# EAGLE design ArduiniBrd (EAGLE 5.12)
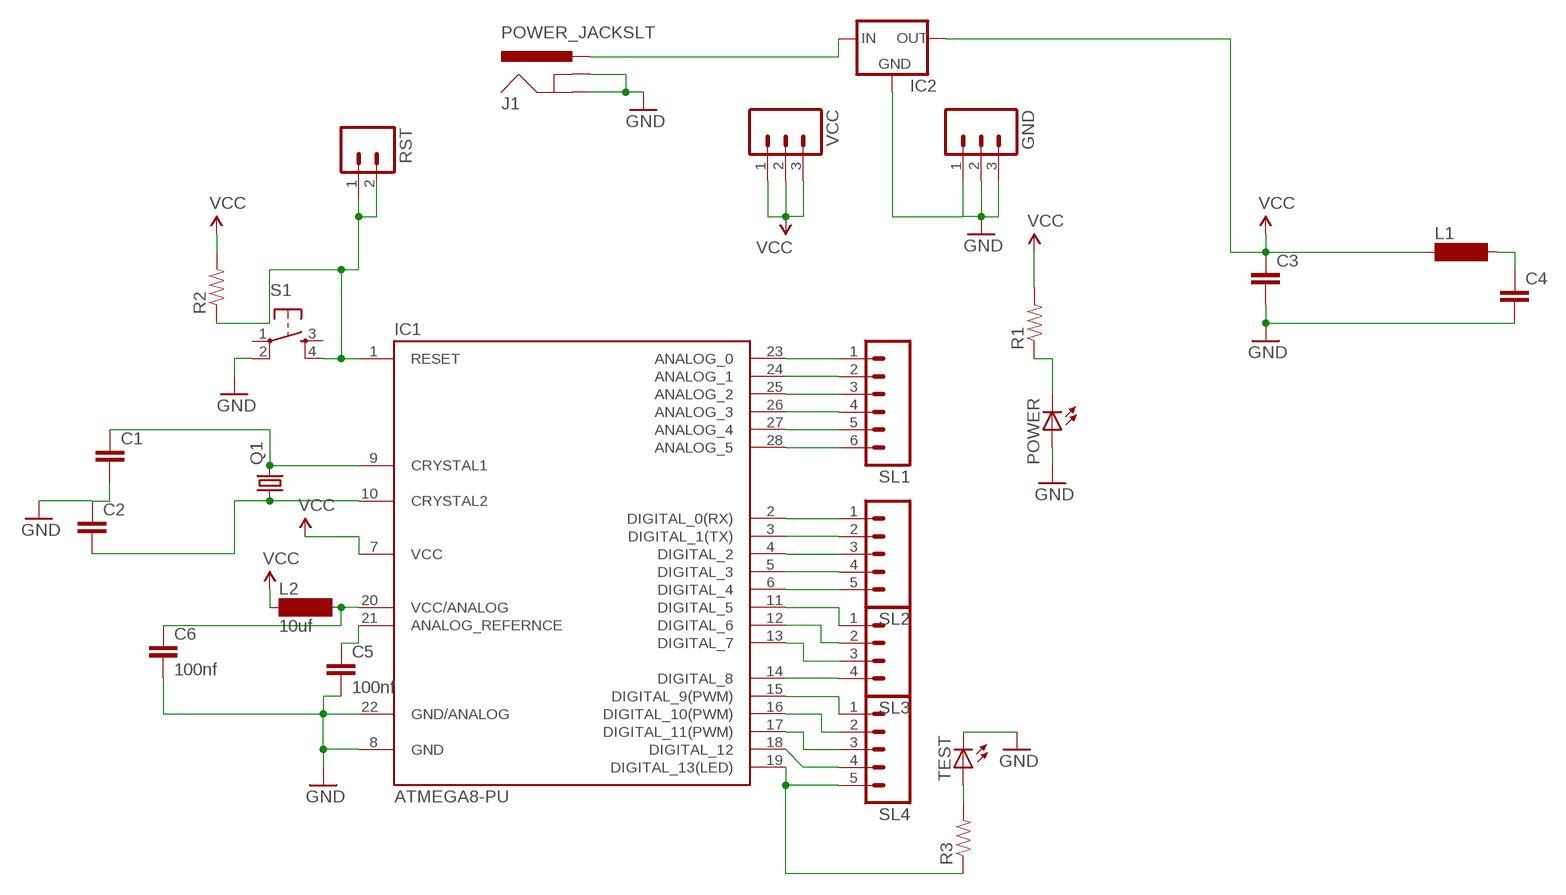
[diagram p0: schematic, sheet 1]

## Parts
C1  CAPPTH  [CAP-PTH-SMALL]
C2  CAPPTH  [CAP-PTH-SMALL]
C3  CAPPTH  [CAP-PTH-SMALL]
C4  CAPPTH  [CAP-PTH-SMALL]
C5  100nf  CAPPTH  [CAP-PTH-SMALL]
C6  100nf  CAPPTH  [CAP-PTH-SMALL]
GND  M03  [03P]
IC1  ATMEGA8-PU  [DIL28-3]
IC2  V_REG_78XXSIDE  [78XXL]
J1  POWER_JACKSLT  [POWER_JACK_SLOT]
L1  SD75  [SD75]
L2  10uf  SD75  [SD75]
POWER  LED5MM  [LED5MM]
Q1  CRYSTALHC18U-V  [HC18U-V]
R1  RESISTORKIT  [AXIAL-0.3-KIT]
R2  RESISTORKIT  [AXIAL-0.3-KIT]
R3  RESISTORPTH-1/6W  [1/6W-RES]
RST  M02  [02P]
S1  TAC_SWITCHPTH  [TACTILE-PTH]
SL1  M06  [06P]
SL2  M05  [05P]
SL3  M04  [04P]
SL4  M05  [05P]
TEST  LED5MM  [LED5MM]
VCC  M03  [03P]

## Nets
GND: C1.2 C2.1 C3.2 C4.2 C5.2 C6.2 GND.1 GND.2 GND.3 IC1.8(GND) IC1.22(GND/ANALOG) IC2.GND J1.GND@1(GNDBREAK) J1.GND@2(GND) POWER.A S1.2 TEST.K(C)
N$1: C1.1 IC1.9(CRYSTAL1) Q1.2
N$2: C2.2 IC1.10(CRYSTAL2) Q1.1
N$3: IC1.18(DIGITAL_12) SL4.4
N$4: POWER.K(C) R1.P$1
N$5: R3.2 TEST.A
N$6: IC1.19(DIGITAL_13(LED)) R3.1 SL4.5
N$7: IC1.1(RESET) R2.P$1 RST.1 S1.4
N$8: IC1.17(DIGITAL_11(PWM)) SL4.3
N$9: IC1.23(ANALOG_0) SL1.1
N$10: IC1.24(ANALOG_1) SL1.2
N$11: IC1.25(ANALOG_2) SL1.3
N$12: IC1.26(ANALOG_3) SL1.4
N$13: IC1.27(ANALOG_4) SL1.5
N$14: IC1.28(ANALOG_5) SL1.6
N$15: IC1.2(DIGITAL_0(RX)) SL2.1
N$16: IC1.3(DIGITAL_1(TX)) SL2.2
N$17: IC1.4(DIGITAL_2) SL2.3
N$18: IC1.5(DIGITAL_3) SL2.4
N$19: IC1.6(DIGITAL_4) SL2.5
N$20: IC1.15(DIGITAL_9(PWM)) SL4.1
N$21: IC1.11(DIGITAL_5) SL3.1
N$22: IC1.12(DIGITAL_6) SL3.2
N$23: IC1.13(DIGITAL_7) SL3.3
N$24: IC1.14(DIGITAL_8) SL3.4
N$25: IC1.16(DIGITAL_10(PWM)) SL4.2
N$26: IC2.IN J1.PWR
N$27: C6.1 IC1.20(VCC/ANALOG) L2.2
N$28: C4.1 L1.2
N$29: C5.1 IC1.21(ANALOG_REFERNCE)
VCC: C3.1 IC1.7(VCC) IC2.OUT L1.1 L2.1 R1.P$2 R2.P$2 VCC.1 VCC.2 VCC.3
Unconnected: RST.2 S1.1 S1.3

## Library data of the parts
C1-C6 = SparkFun:CAP: Capacitor Standard 0603 ceramic capacitor, and 0.1" leaded capacitor.
GND VCC = con-amp-quick:M03: AMP QUICK CONNECTOR; OC_FARNELL: unknown; OC_NEWARK: unknown
IC1 = Arduino-AVR:ATMEGA8-PU
IC2 = SparkFun:V_REG_78XX: Voltage Regulator Standard 7805 5V regulator. IGO (Input Ground Output). Spark Fun Electronics SKU : COM-00107
J1 = SparkFun:POWER_JACK: Power Jack This is the standard 5.5mm barrel jack for power. The PTH is the most common, proven, reliable, footprint. All others are experimental. The Slot footprint only works if the mill layer is transmitted to the PCB fab house so be warned. Spark Fun Electronics SKU : PRT-00119. Mating wall wart : TOL-00298 (and others)
L1 L2 = inductor-neosid:SD75: INDUCTOR nominal inductance, E12; OC_FARNELL: unknown; OC_NEWARK: unknown
POWER TEST = led:LED: LED OSRAM: - CHIPLED LG R971, LG N971, LY N971, LG Q971, LY Q971, LO R971, LY R971 LH N974, LH R974 LS Q976, LO Q976, LY Q976 LO Q996 - Hyper CHIPLED LW Q18S LB Q993, LB Q99A, LB R99A - SideLED LS A670, LO A670, LY A670, LG A670, LP A670 LB A673, LV A673, LT A673, LW A673 LH A674 LY A675 LS A676, LA A676, LO A676, LY A676, LW A676 LS A679, LY A679, LG A679 - Hyper Micro SIDELED® LS Y876, LA Y876, LO Y876, LY Y876 LT Y87S - SmartLED LW L88C, LW L88S LB L89C, LB L89S, LG L890 LS L89K, LO L89K, LY L89K LS L896, LA L896, LO L896, LY L896 - TOPLED LS T670, LO T670, LY T670, LG T670, LP T670 LSG T670, LSP T670, LSY T670, LOP T670, LYG T670 LG T671, LOG T671, LSG T671 LB T673, LV T673, LT T673, LW T673 LH T674 LS T676, LA T676, LO T676, LY T676, LB T676, LH T676, LSB T676, LW T676 LB T67C, LV T67C, LT T67C, LS T67K, LO T67K, LY T67K, LW E67C LS E67B, LA E67B, LO E67B, LY E67B, LB E67C, LV E67C, LT E67C LW T67C LS T679, LY T679, LG T679 LS T770, LO T770, LY T770, LG T770, LP T770 LB T773, LV T773, LT T773, LW T773 LH T774 LS E675, LA E675, LY E675, LS T675 LS T776, LA T776, LO T776, LY T776, LB T776 LHGB T686 LT T68C, LB T68C - Hyper Mini TOPLED® LB M676 - Mini TOPLED Santana® LG M470 LS M47K, LO M47K, LY M47K Source: http://www.osram.convergy.de LUXEON: - LUMILED® LXK2-PW12-R00, LXK2-PW12-S00, LXK2-PW14-U00, LXK2-PW14-V00 LXK2-PM12-R00, LXK2-PM12-S00, LXK2-PM14-U00 LXK2-PE12-Q00, LXK2-PE12-R00, LXK2-PE12-S00, LXK2-PE14-T00, LXK2-PE14-U00 LXK2-PB12-K00, LXK2-PB12-L00, LXK2-PB12-M00, LXK2-PB14-N00, LXK2-PB14-P00, LXK2-PB14-Q00 LXK2-PR12-L00, LXK2-PR12-M00, LXK2-PR14-Q00, LXK2-PR14-R00 LXK2-PD12-Q00, LXK2-PD12-R00, LXK2-PD12-S00 LXK2-PH12-R00, LXK2-PH12-S00 LXK2-PL12-P00, LXK2-PL12-Q00, LXK2-PL12-R00 Source: www.luxeon.com KINGBRIGHT: KA-3528ASYC Source: www.kingbright.com
Q1 = crystal:CRYSTAL: CRYSTAL; OC_FARNELL: unknown; OC_NEWARK: unknown
R1-R3 = SparkFun:RESISTOR: Resistor Basic schematic elements and footprints for 0603, 1206, and PTH resistors.
RST = con-amp-quick:M02: AMP QUICK CONNECTOR; OC_FARNELL: unknown; OC_NEWARK: unknown
S1 = SparkFun:TAC_SWITCH: Momentary Switch Button commonly used for reset or general input. Spark Fun Electronics SKU : COM-00097
SL1 = con-amp-quick:M06: AMP QUICK CONNECTOR; OC_FARNELL: unknown; OC_NEWARK: unknown
SL2 SL4 = con-amp-quick:M05: AMP QUICK CONNECTOR; OC_FARNELL: unknown; OC_NEWARK: unknown
SL3 = con-amp-quick:M04: AMP QUICK CONNECTOR; OC_FARNELL: unknown; OC_NEWARK: unknown

## Board
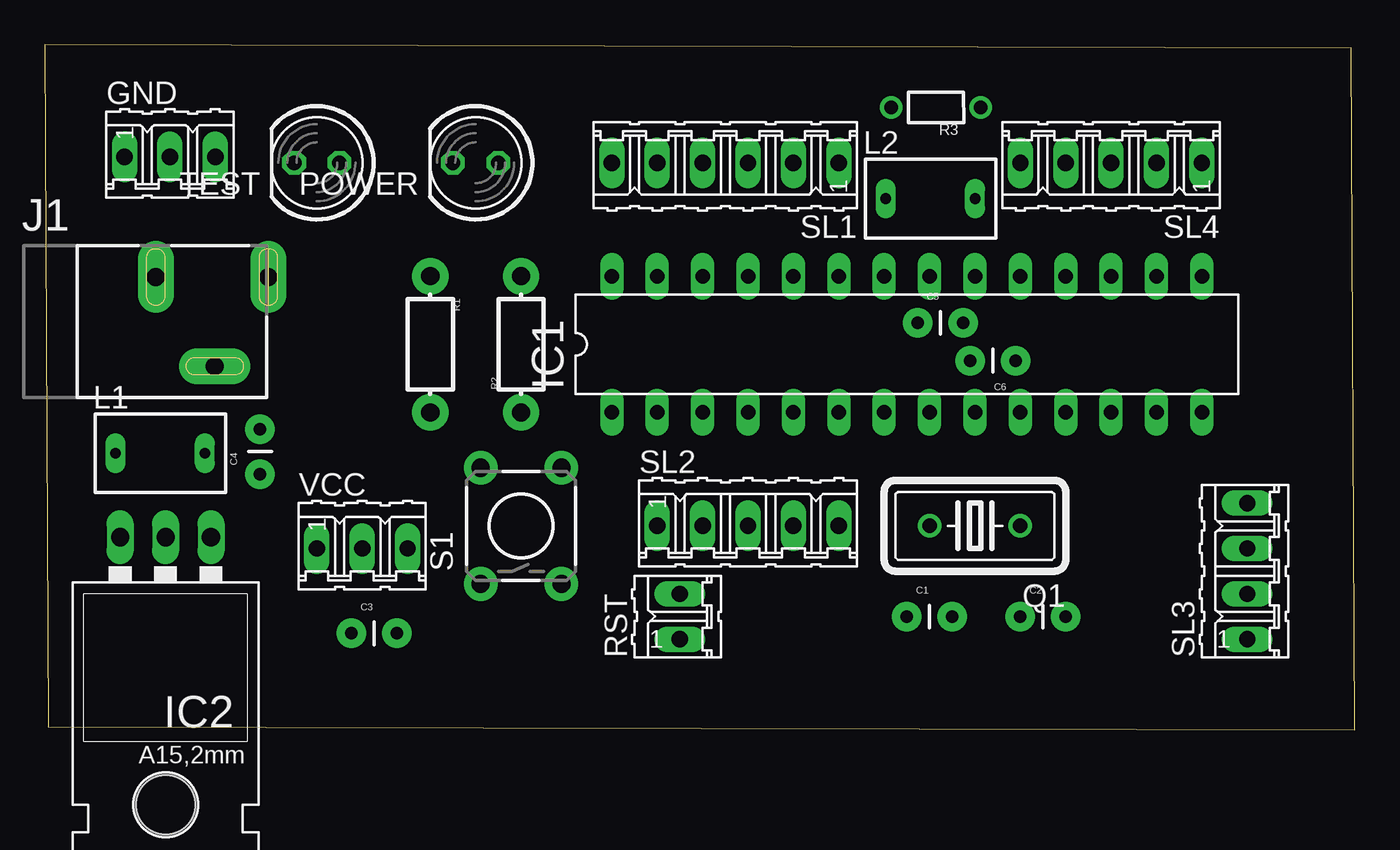
[diagram p1: board, top side]
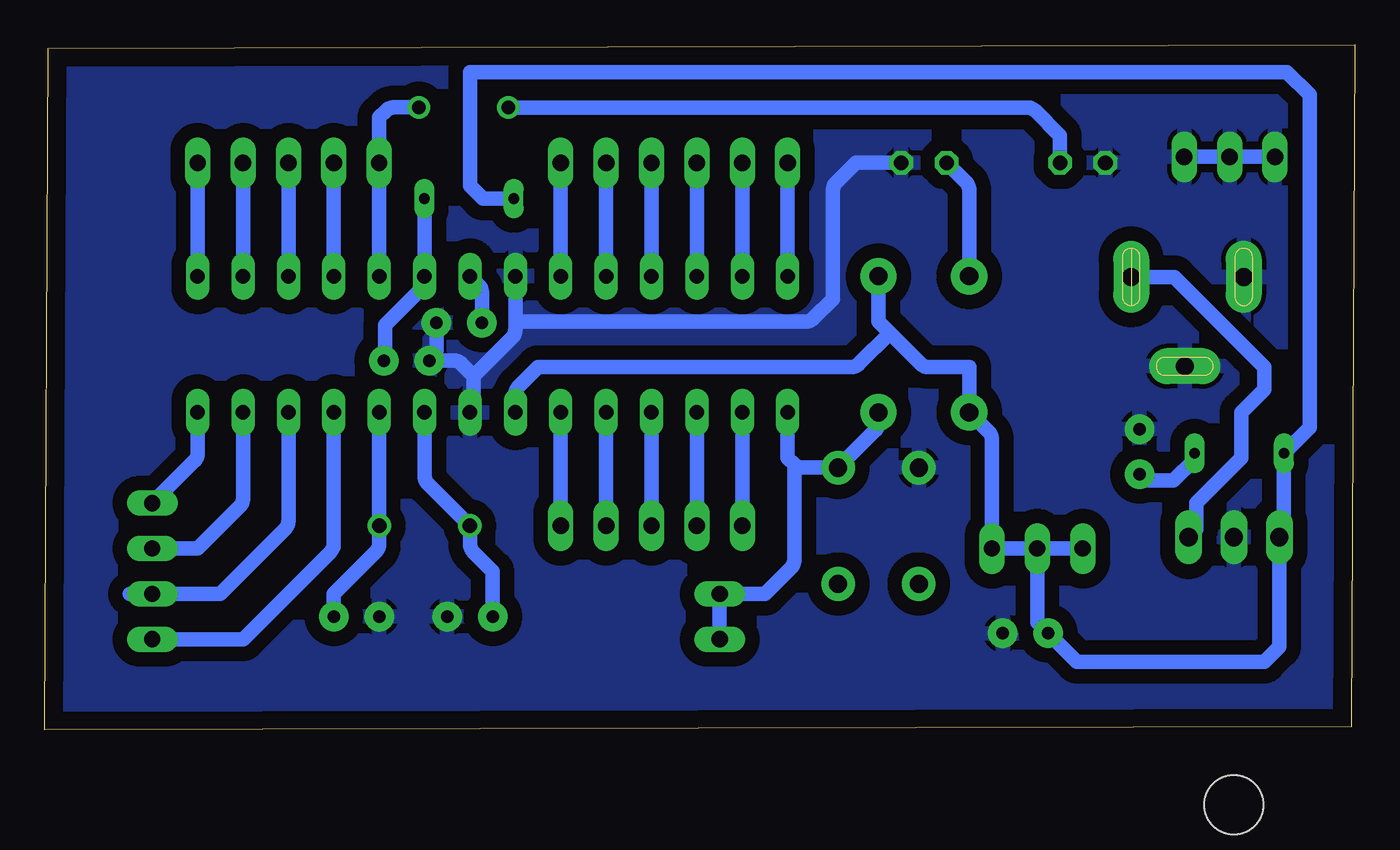
[diagram p2: board, bottom side, seen from below]

Size 73.32 x 38.36 mm. Coordinates in mm from the lower left corner, seen from the top.
Outline: 0.19,0.19 73.32,0 73.14,38.18 0,38.36 0.19,0.19
Copper layers (1*16): Top 0.035mm / dielectric 1.5mm / Bottom 0.035mm
Design rules "default": minimum track width 10mil, minimum drill 24mil, track to track 8mil, track to pad 8mil, pad to pad 8mil, via to via 8mil, smd to smd 8mil, copper to edge 40mil, drill to drill 8mil, minimum pad ring 10mil, minimum via ring 8mil, stop-mask expansion 4mil, vias tented up to drill 0mil, thermal gap 10mil

### Footprints (pad centres in the part's own frame; a part is rotated, then mirrored left to right if it is on the bottom)
CAP-PTH-SMALL = drill 0.7 pad 1.651 round: 1 0,0; 2 2.54,0
03P = drill 0.914 long: 1 -2.54,0; 2 0,0; 3 2.54,0
DIL28-3 = drill 0.813 long: 1 -16.51,-3.81; 2 -13.97,-3.81; 3 -11.43,-3.81; 4 -8.89,-3.81; 5 -6.35,-3.81; 6 -3.81,-3.81; 7 -1.27,-3.81; 8 1.27,-3.81; 9 3.81,-3.81; 10 6.35,-3.81; 11 8.89,-3.81; 12 11.43,-3.81; 13 13.97,-3.81; 14 16.51,-3.81; 15 16.51,3.81; 16 13.97,3.81; 17 11.43,3.81; 18 8.89,3.81; 19 6.35,3.81; 20 3.81,3.81; 21 1.27,3.81; 22 -1.27,3.81; 23 -3.81,3.81; 24 -6.35,3.81; 25 -8.89,3.81; 26 -11.43,3.81; 27 -13.97,3.81; 28 -16.51,3.81
78XXL = drill 1.016 long: GND 0,-3.81; IN -2.54,-3.81; OUT 2.54,-3.81 | hole 3.302: 0,11.176
POWER_JACK_SLOT = drill 1 pad 2 long: GND@1 2.58,7.5; GND@2 7.58,10.8; PWR 2.58,13.8
SD75 = drill 0.6 long: 1 -2.5,0; 2 2.5,0
LED5MM = drill 0.813 octagon: A -1.27,0; K 1.27,0
HC18U-V = drill 0.813 round: 1 -2.54,0; 2 2.54,0
AXIAL-0.3-KIT = drill 1.016 pad 2.032 round: P$1 -3.81,0; P$2 3.81,0
1/6W-RES = drill 0.762 round: 1 -2.5,0; 2 2.5,0
02P = drill 0.914 long: 1 -1.27,0; 2 1.27,0
TACTILE-PTH = drill 1.016 pad 1.88 round: 1 -3.251,2.261; 2 3.251,2.261; 3 -3.251,-2.261; 4 3.251,-2.261
06P = drill 0.914 long: 1 -6.35,0; 2 -3.81,0; 3 -1.27,0; 4 1.27,0; 5 3.81,0; 6 6.35,0
05P = drill 0.914 long: 1 -5.08,0; 2 -2.54,0; 3 0,0; 4 2.54,0; 5 5.08,0
04P = drill 0.914 long: 1 -3.81,0; 2 -1.27,0; 3 1.27,0; 4 3.81,0

### Placement (x,y rotation side)
C1  48.25,6.35 0 top
C2  54.6,6.35 0 top
C3  17.16,5.41 0 top
C4  12.06,14.31 90 top
C5  48.85,22.79 0 top
C6  54.33,20.68 180 top
GND  7.01,32.08 0 top
IC1  48.25,21.59 0 top
IC2  6.76,6.98 180 top
J1  -1.28,27.94 270 top
L1  6.47,15.48 0 top
L2  49.57,29.75 0 top
POWER  24.12,31.75 180 top
Q1  52.06,11.43 180 top
R1  21.58,21.59 270 top
R2  26.66,21.59 90 top
R3  49.88,34.85 180.1 top
RST  35.55,6.35 90 top
S1  26.66,11.43 90 top
SL1  38.09,31.75 180 top
SL2  39.36,11.43 0 top
SL3  67.3,8.89 90 top
SL4  59.68,31.75 180 top
TEST  15.23,31.75 180 top
VCC  17.77,10.16 0 top

### Tracks (layer width: path | path; a pad name or v marks a point on that pad's centre or on a via)
GND
  Bottom 0.813: GND.1 GND.2 GND.3 | 46.98,22.86 IC1.22 | 46.98,22.86 30.73,22.86 arc-45 30.28,23.05 29.2,24.13 29.2,30.22 arc45 29.01,30.67 27.93,31.75 POWER.A | 46.98,22.86 46.98,22.41 arc45 47.17,21.96 49.31,19.82 | 49.31,19.82 49.31,18.26 arc45 49.49,17.81 IC1.8 | 49.31,19.82 49.98,20.49 arc-45 50.43,20.68 C6.2 51.58,20.89 arc-45 51.39,21.34 C5.2
  pour Bottom (isolate 0.813): 1.26,1.27 1.26,36.83 71.75,36.83 arc-90 72.38,36.2 72.38,1.27
N$1
  Bottom 0.813: IC1.9 52.06,14.23 arc-45 51.87,13.78 Q1.2 49.52,10.42 arc-45 49.33,9.97 48.25,8.89 C1.1
N$2
  Bottom 0.813: IC1.10 Q1.1 54.6,10.42 arc45 54.79,9.97 57.14,7.62 C2.2
N$3
  Bottom 0.813: IC1.18 SL4.4
N$4
  Bottom 0.813: R1.P$1 21.58,30.22 arc-45 21.77,30.67 POWER.K
N$5
  Bottom 0.813: R3.2 18.33,34.84 arc45 17.88,34.66 16.5,33.27 TEST.A
N$6
  Bottom 0.813: IC1.19 SL4.5 54.6,34.29 54.22,34.67 arc45 53.78,34.85 R3.1
N$7
  Bottom 0.813: 31.37,14.87 arc-45 30.92,14.68 | 31.37,14.87 31.74,15.24 IC1.1 | R2.P$1 26.66,17.2 arc45 26.85,16.76 S1.4 30.92,14.68 | 31.37,14.87 arc-45 30.92,14.68 | 31.37,14.87 31.37,9.53 arc45 31.55,9.08 33.01,7.62 35.55,7.62 RST.1
N$8
  Bottom 0.813: IC1.17 SL4.3
N$9
  Bottom 0.813: IC1.23 SL1.1
N$10
  Bottom 0.813: IC1.24 SL1.2
N$11
  Bottom 0.813: IC1.25 SL1.3
N$12
  Bottom 0.813: IC1.26 SL1.4
N$13
  Bottom 0.813: IC1.27 SL1.5
N$14
  Bottom 0.813: IC1.28 SL1.6
N$15
  Bottom 0.813: SL2.1 IC1.2
N$16
  Bottom 0.813: SL2.2 IC1.3
N$17
  Bottom 0.813: SL2.3 IC1.4
N$18
  Bottom 0.813: SL2.4 IC1.5
N$19
  Bottom 0.813: SL2.5 IC1.6
N$20
  Bottom 0.813: IC1.15 SL4.1
N$21
  Bottom 0.813: IC1.11 57.14,10.42 arc45 57.33,9.97 62.22,5.08 SL3.1
N$22
  Bottom 0.813: IC1.12 59.68,11.69 arc45 59.87,11.24 63.49,7.62 SL3.2 68.57,7.62
N$23
  Bottom 0.813: IC1.13 62.22,12.96 arc45 62.41,12.51 64.76,10.16 SL3.3
N$24
  Bottom 0.813: IC1.14 64.76,15.5 arc45 64.95,15.05 SL3.4
N$25
  Bottom 0.813: IC1.16 SL4.2
N$26
  Bottom 0.813: J1.PWR 10.11,25.36 5.07,20.32 5.07,19.05 6.34,17.78 6.34,15.24 8.88,12.7 8.88,11.22 IC2.IN
N$27
  Bottom 0.813: C6.1 arc-45 54.27,20.82 54.27,22.66 52.25,24.69 arc-45 52.06,25.14 IC1.20 52.06,29.72 arc-45 L2.2
N$28
  Bottom 0.813: L1.2 8.97,15.15 10.15,13.97 11.72,13.97 C4.1
N$29
  Bottom 0.813: C5.1 48.85,24.47 arc-45 49.04,24.91 IC1.21
VCC
  Bottom 0.813: VCC.2 VCC.1 | VCC.2 VCC.3 20.31,16.25 arc-45 20.5,16.7 R1.P$2 21.58,20.32 23.86,20.32 arc45 24.31,20.51 26.03,22.22 | 26.03,22.22 26.66,22.86 R2.P$2 | IC1.7 46.98,18.79 arc45 46.79,19.24 45.71,20.32 28.19,20.32 arc-45 27.74,20.51 26.03,22.22 | VCC.2 17.77,6.02 C3.1 15.56,3.81 5.07,3.81 4.22,4.66 IC2.OUT 3.97,11.05 L1.1 2.53,16.92 2.53,35.56 3.8,36.83 49.52,36.83 49.52,30.48 48.79,29.75 L2.1